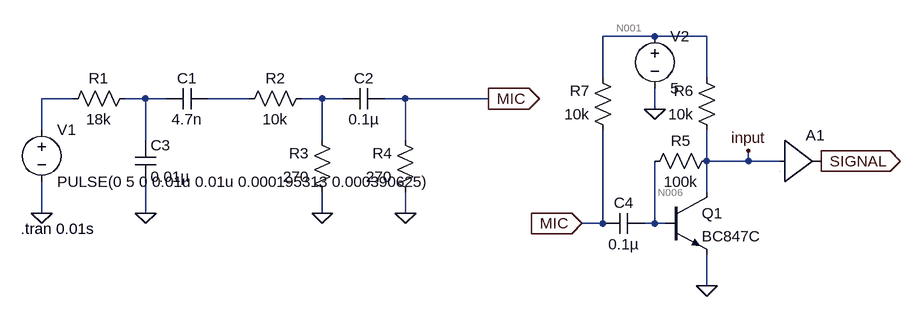
[diagram p0: schematic cmt-out.asc]
cmt-out.asc, the LTspice schematic file:
Version 4
SHEET 1 1840 680
WIRE 944 -208 864 -208
WIRE 1024 -208 944 -208
WIRE 864 -144 864 -208
WIRE 1024 -144 1024 -208
WIRE 48 -112 0 -112
WIRE 160 -112 128 -112
WIRE 192 -112 160 -112
WIRE 320 -112 256 -112
WIRE 432 -112 400 -112
WIRE 464 -112 432 -112
WIRE 560 -112 528 -112
WIRE 688 -112 560 -112
WIRE 944 -96 944 -128
WIRE 0 -64 0 -112
WIRE 160 -48 160 -112
WIRE 432 -48 432 -112
WIRE 560 -48 560 -112
WIRE 1024 -16 1024 -64
WIRE 1088 -16 1088 -32
WIRE 1088 -16 1024 -16
WIRE 1136 -16 1088 -16
WIRE 1024 32 1024 -16
WIRE 0 64 0 16
WIRE 160 64 160 16
WIRE 432 64 432 32
WIRE 560 64 560 32
WIRE 864 80 864 -64
WIRE 864 80 832 80
WIRE 944 80 944 -16
WIRE 944 80 928 80
WIRE 960 80 944 80
WIRE 1024 176 1024 128
FLAG 0 64 0
FLAG 432 64 0
FLAG 560 64 0
FLAG 160 64 0
FLAG 688 -112 MIC
IOPIN 688 -112 Out
FLAG 832 80 MIC
IOPIN 832 80 In
FLAG 1024 176 0
FLAG 1200 -16 SIGNAL
IOPIN 1200 -16 Out
FLAG 944 -96 0
FLAG 1088 -32 input
SYMBOL voltage 0 -80 R0
WINDOW 123 0 0 Left 2
WINDOW 39 0 0 Left 2
SYMATTR InstName V1
SYMATTR Value PULSE(0 5 0 0.01u 0.01u 0.000195313 0.000390625)
SYMBOL res 144 -128 R90
WINDOW 0 0 56 VBottom 2
WINDOW 3 32 56 VTop 2
SYMATTR InstName R1
SYMATTR Value 18k
SYMBOL res 416 -128 R90
WINDOW 0 0 56 VBottom 2
WINDOW 3 32 56 VTop 2
SYMATTR InstName R2
SYMATTR Value 10k
SYMBOL res 448 48 R180
WINDOW 0 36 76 Left 2
WINDOW 3 36 40 Left 2
SYMATTR InstName R3
SYMATTR Value 270
SYMBOL res 576 48 R180
WINDOW 0 36 76 Left 2
WINDOW 3 36 40 Left 2
SYMATTR InstName R4
SYMATTR Value 270
SYMBOL cap 256 -128 R90
WINDOW 0 0 32 VBottom 2
WINDOW 3 32 32 VTop 2
SYMATTR InstName C1
SYMATTR Value 4.7n
SYMBOL cap 528 -128 R90
WINDOW 0 0 32 VBottom 2
WINDOW 3 32 32 VTop 2
SYMATTR InstName C2
SYMATTR Value 0.1µ
SYMBOL cap 144 -48 R0
SYMATTR InstName C3
SYMATTR Value 0.01µ
SYMBOL cap 928 64 R90
WINDOW 0 0 32 VBottom 2
WINDOW 3 32 32 VTop 2
SYMATTR InstName C4
SYMATTR Value 0.1µ
SYMBOL res 1040 -32 R90
WINDOW 0 0 56 VBottom 2
WINDOW 3 32 56 VTop 2
SYMATTR InstName R5
SYMATTR Value 100k
SYMBOL res 1040 -48 R180
WINDOW 0 36 76 Left 2
WINDOW 3 36 40 Left 2
SYMATTR InstName R6
SYMATTR Value 10k
SYMBOL res 880 -48 R180
WINDOW 0 36 76 Left 2
WINDOW 3 36 40 Left 2
SYMATTR InstName R7
SYMATTR Value 10k
SYMBOL npn 960 32 R0
SYMATTR InstName Q1
SYMATTR Value BC847C
SYMBOL voltage 944 -224 R0
WINDOW 123 0 0 Left 2
WINDOW 39 0 0 Left 2
SYMATTR InstName V2
SYMATTR Value 5
SYMBOL Digital\\buf1 1136 -80 R0
SYMATTR InstName A1
TEXT -32 88 Left 2 !.tran 0.01s

The netlist it stands for:
* cmt-out.asc
V1 N002 0 PULSE(0 5 0 0.01u 0.01u 0.000195313 0.000390625)
R1 N003 N002 18k
R2 N005 N004 10k
R3 0 N005 270
R4 0 MIC 270
C1 N004 N003 4.7n
C2 MIC N005 0.1µ
C3 N003 0 0.01µ
C4 N006 MIC 0.1µ
R5 input N006 100k
R6 input N001 10k
R7 MIC N001 10k
Q1 input N006 0 0 BC847C
V2 N001 0 5
A1 input 0 0 0 0 0 SIGNAL 0 BUF
.model NPN NPN
.model PNP PNP
.lib standard.bjt
.tran 0.01s
.backanno
.end

* Results of the author's LTspice run, read from the files saved beside the schematic
* Operating Point, zero values left out:
*   V(mic) = 131.5 mV
*   V(n006) = 607.7 mV
*   V(input) = 696.6 mV
*   V(n001) = 5 V
*   V(signal) = 1 V
*   Ic(Q1) = 429.5 µA
*   Ib(Q1) = 889.1 nA
*   Ie(Q1) = -430.3 µA
*   I(R7) = -486.9 µA
*   I(R6) = -430.3 µA
*   I(R5) = 889.2 nA
*   I(R4) = -486.9 µA
*   I(V2) = -917.2 µA
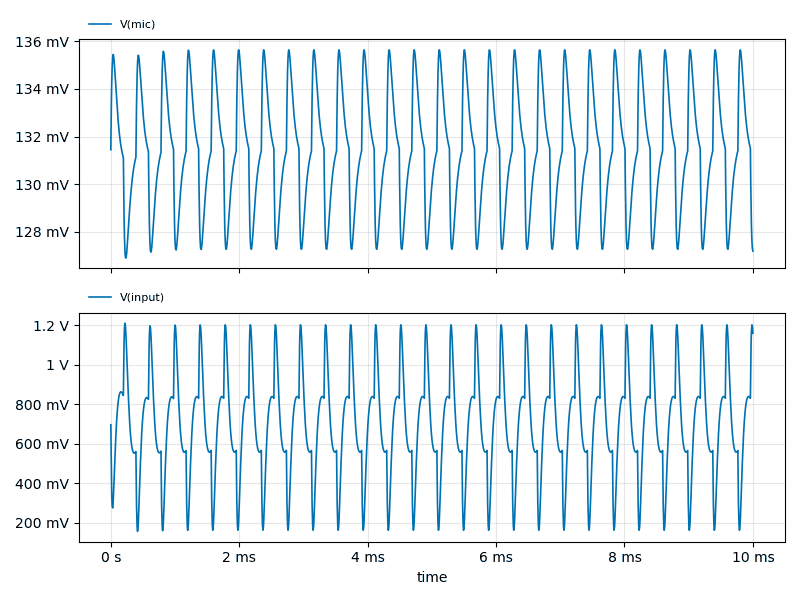
[diagram p1: Transient Analysis of cmt-out.asc, plotted from the saved traces]
* Transient Analysis, 1 run:
*   V(mic): min 126.9 mV, max 135.6 mV, average 131.5 mV, rms 131.5 mV, last 127.2 mV
*   V(input): min 157.5 mV, max 1.21 V, average 698.4 mV, rms 745.3 mV, last 1.159 V